# EAGLE design LoginatorCore (EAGLE 6.2)
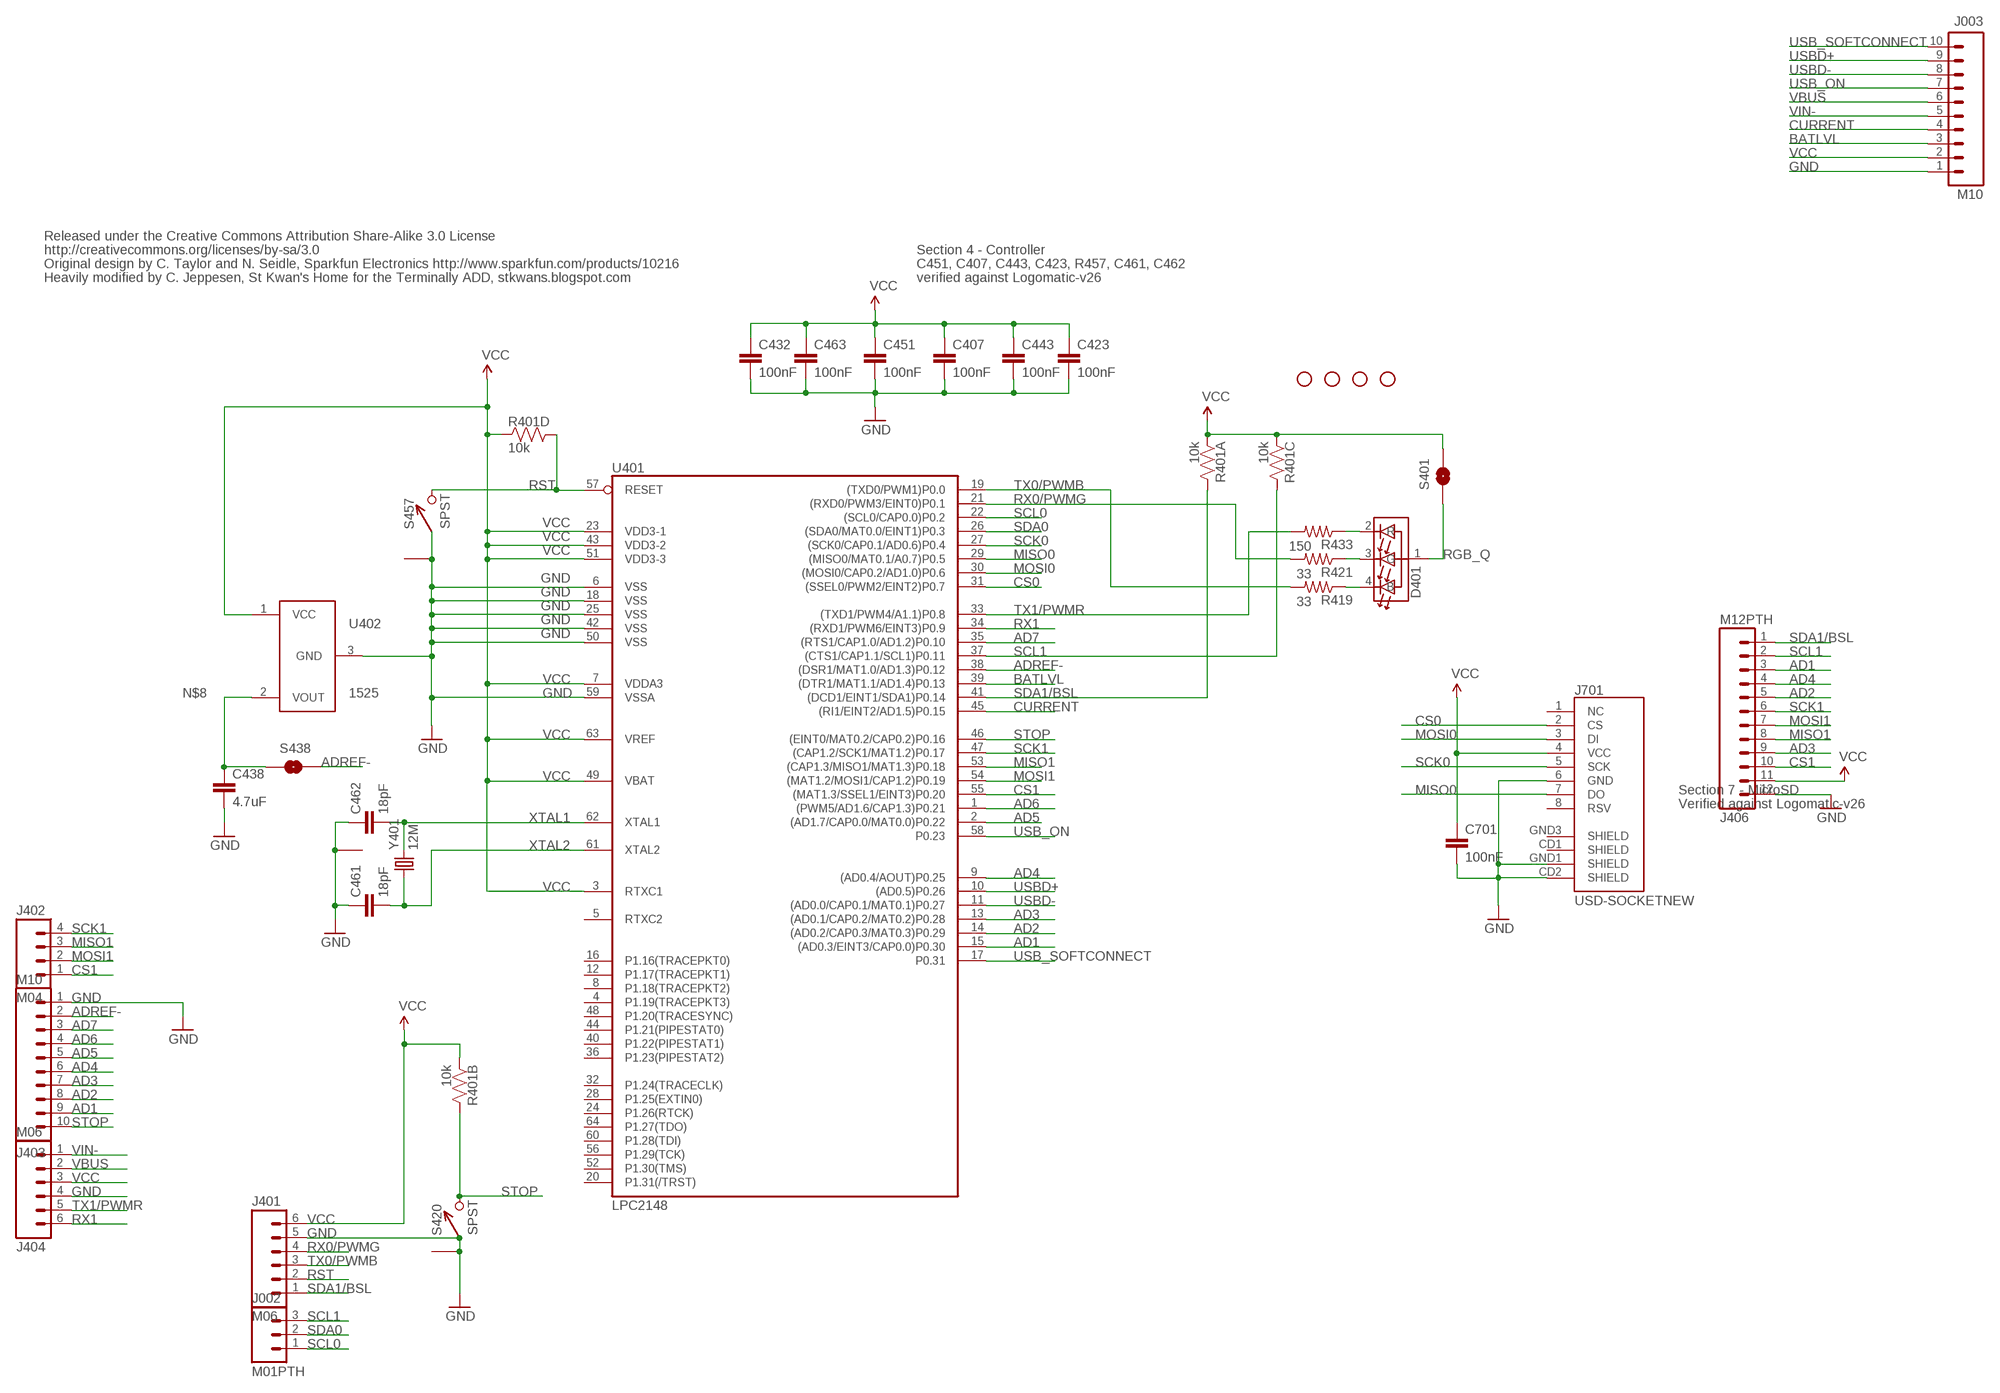
[diagram p0: schematic, sheet 1]

## Parts
C407  100nF  CAP0402-CAP  [0402-CAP]
C423  100nF  CAP0402-CAP  [0402-CAP]
C432  100nF  CAP0402-CAP  [0402-CAP]
C438  4.7uF  CAP0402-CAP  [0402-CAP]
C443  100nF  CAP0402-CAP  [0402-CAP]
C451  100nF  CAP0402-CAP  [0402-CAP]
C461  18pF  CAP0402-CAP  [0402-CAP]
C462  18pF  CAP0402-CAP  [0402-CAP]
C463  100nF  CAP0402-CAP  [0402-CAP]
C701  100nF  CAP0402-CAP  [0402-CAP]
D401  HSMF-C118  [HSMF-C118]
J002  M01PTH  M03PTH  [1X03]
J003  M10  M10"  [1X10]
J401  M06  M06SIP  [1X06]
J402  M04  M04PTH  [1X04]
J403  M10  M10"  [1X10]
J404  M06  M06SIP  [1X06]
J406  M12PTH  [1X12]
J701  USD-SOCKETNEW  [MICRO-SD-SOCKET-PP]
JP1  STAND-OFF  [STAND-OFF]
JP2  STAND-OFF  [STAND-OFF]
JP3  STAND-OFF  [STAND-OFF]
JP4  STAND-OFF  [STAND-OFF]
R401  10k  RP404  [CRA04]
R419  33  RESISTOR0402-RES  [0402-RES]
R421  33  RESISTOR0402-RES  [0402-RES]
R433  150  RESISTOR0402-RES  [0402-RES]
S401  SOLDERJUMPERNO  [SJ_2S-NO]
S420  SPST  B3U-1100P  [B3U-1100P]
S438  SOLDERJUMPERNO  [SJ_2S-NO]
S457  SPST  B3U-1100P  [B3U-1100P]
U401  LPC2148  LPC213X  [SQFP-S-10X10-64]
U402  1525  MCP1525  [SOT-23-3]
Y401  12M  TSX-3225  [CRYSTAL_SMD]

## Nets
AD1: J403.9 J406.3 U401.15((AD0.3/EINT3/CAP0.0)P0.30)
AD2: J403.8 J406.5 U401.14((AD0.2/CAP0.3/MAT0.3)P0.29)
AD3: J403.7 J406.9 U401.13((AD0.1/CAP0.2/MAT0.2)P0.28)
AD4: J403.6 J406.4 U401.9((AD0.4/AOUT)P0.25)
AD5: J403.5 U401.2((AD1.7/CAP0.0/MAT0.0)P0.22)
AD6: J403.4 U401.1((PWM5/AD1.6/CAP1.3)P0.21)
AD7: J403.3 U401.35((RTS1/CAP1.0/AD1.2)P0.10)
ADREF-: J403.2 S438.2 U401.38((DSR1/MAT1.0/AD1.3)P0.12)
BATLVL: J003.3 U401.39((DTR1/MAT1.1/AD1.4)P0.13)
CS0: J701.2(CS) U401.31((SSEL0/PWM2/EINT2)P0.7)
CS1: J402.1 J406.10 U401.55((MAT1.3/SSEL1/EINT3)P0.20)
CURRENT: J003.4 U401.45((RI1/EINT2/AD1.5)P0.15)
DB: D401.4(B) R419.1
DG: D401.3(G) R421.1
DR: D401.2(R) R433.1
GND: C407.2 C423.2 C432.2 C438.2 C443.2 C451.2 C461.1 C462.1 C463.2 C701.2 J003.1 J401.5 J403.1 J404.4 J406.12 J701.6(GND) J701.CD2(SHIELD) J701.GND1(SHIELD) S420.P$1 S420.P$3 S457.P$1 S457.P$3 U401.6(VSS) U401.18(VSS) U401.25(VSS) U401.42(VSS) U401.50(VSS) U401.59(VSSA) U402.3(GND) Y401.2 Y401.4
MISO0: J701.7(DO) U401.29((MISO0/MAT0.1/A0.7)P0.5)
MISO1: J402.3 J406.8 U401.53((CAP1.3/MISO1/MAT1.3)P0.18)
MOSI0: J701.3(DI) U401.30((MOSI0/CAP0.2/AD1.0)P0.6)
MOSI1: J402.2 J406.7 U401.54((MAT1.2/MOSI1/CAP1.2)P0.19)
N$8: C438.1 S438.1 U402.2(VOUT)
RGB_Q: D401.1(A) S401.1
RST: J401.2 R401.5 S457.P$2 U401.57(RESET)
RX0/PWMG: J401.4 R421.2 U401.21((RXD0/PWM3/EINT0)P0.1)
RX1: J404.6 U401.34((RXD1/PWM6/EINT3)P0.9)
SCK0: J701.5(SCK) U401.27((SCK0/CAP0.1/AD0.6)P0.4)
SCK1: J402.4 J406.6 U401.47((CAP1.2/SCK1/MAT1.2)P0.17)
SCL0: J002.1 U401.22((SCL0/CAP0.0)P0.2)
SCL1: J002.3 J406.2 R401.6 U401.37((CTS1/CAP1.1/SCL1)P0.11)
SDA0: J002.2 U401.26((SDA0/MAT0.0/EINT1)P0.3)
SDA1/BSL: J401.1 J406.1 R401.8 U401.41((DCD1/EINT1/SDA1)P0.14)
STOP: J403.10 R401.7 S420.P$2 U401.46((EINT0/MAT0.2/CAP0.2)P0.16)
TX0/PWMB: J401.3 R419.2 U401.19((TXD0/PWM1)P0.0)
TX1/PWMR: J404.5 R433.2 U401.33((TXD1/PWM4/A1.1)P0.8)
USB_ON: J003.7 U401.58(P0.23)
USB_SOFTCONNECT: J003.10 U401.17(P0.31)
USBD+: J003.9 U401.10((AD0.5)P0.26)
USBD-: J003.8 U401.11((AD0.0/CAP0.1/MAT0.1)P0.27)
VBUS [power]: J003.6 J404.2
VCC: C407.1 C423.1 C432.1 C443.1 C451.1 C463.1 C701.1 J003.2 J401.6 J404.3 J406.11 J701.4(VCC) R401.1 R401.2 R401.3 R401.4 S401.2 U401.3(RTXC1) U401.7(VDDA3) U401.23(VDD3-1) U401.43(VDD3-2) U401.49(VBAT) U401.51(VDD3-3) U401.63(VREF) U402.1(VCC)
VIN-: J003.5 J404.1
XTAL1: C462.2 U401.62(XTAL1) Y401.3
XTAL2: C461.2 U401.61(XTAL2) Y401.1
Unconnected: J701.1(NC) J701.8(RSV) J701.CD1(SHIELD) J701.GND3(SHIELD) U401.4(P1.19(TRACEPKT3)) U401.5(RTXC2) U401.8(P1.18(TRACEPKT2)) U401.12(P1.17(TRACEPKT1)) U401.16(P1.16(TRACEPKT0)) U401.20(P1.31(/TRST)) U401.24(P1.26(RTCK)) U401.28(P1.25(EXTIN0)) U401.32(P1.24(TRACECLK)) U401.36(P1.23(PIPESTAT2)) U401.40(P1.22(PIPESTAT1)) U401.44(P1.21(PIPESTAT0)) U401.48(P1.20(TRACESYNC)) U401.52(P1.30(TMS)) U401.56(P1.29(TCK)) U401.60(P1.28(TDI)) U401.64(P1.27(TDO))

## Notes on the sheet
- Released under the Creative Commons Attribution Share-Alike 3.0 License
- http://creativecommons.org/licenses/by-sa/3.0 | Section 4 - Controller
- Original design by C. Taylor and N. Seidle, Sparkfun Electronics http://www.sparkfun.com/products/10216 | C451, C407, C443, C423, R457, C461, C462
- Heavily modified by C. Jeppesen, St Kwan's Home for the Terminally ADD, stkwans.blogspot.com | verified against Logomatic-v26
- Section 7 - MicroSD
- Verified against Logomatic-v26

## Library data of the parts
C407 C423 C432 C438 C443 C451 C461-C463 C701 = SparkFun:CAP: Capacitor Standard 0603 ceramic capacitor, and 0.1" leaded capacitor.
D401 = KwanSystems:HSMF-C118
J002 = SparkFun:M03: Header 3 Standard 3-pin 0.1" header. Use with straight break away headers (SKU : PRT-00116), right angle break away headers (PRT-00553), swiss pins (PRT-00743), machine pins (PRT-00117), and female headers (PRT-00115). Molex polarized connector foot print use with SKU : PRT-08232 with associated crimp pins and housings.
J003 J403 = SparkFun:M10: Header 10 Standard 10-pin 0.1" header. Use with straight break away headers (SKU : PRT-00116), right angle break away headers (PRT-00553), swiss pins (PRT-00743), machine pins (PRT-00117), and female headers (PRT-00115).
J401 J404 = SparkFun:M06: Header 6 Standard 6-pin 0.1" header. Use with straight break away headers (SKU : PRT-00116), right angle break away headers (PRT-00553), swiss pins (PRT-00743), machine pins (PRT-00117), and female headers (PRT-00115). Molex polarized connector foot print use with SKU : PRT-08094 with associated crimp pins and housings. NOTES ON THE VARIANTS LOCK and LOCK_LONGPADS... This footprint was designed to help hold the alignment of a through-hole component (i.e. 6-pin header) while soldering it into place. You may notice that each hole has been shifted either up or down by 0.005 of an inch from it's more standard position (which is a perfectly straight line). This slight alteration caused the pins (the squares in the middle) to touch the edges of the holes. Because they are alternating, it causes a "brace" to hold the component in place. 0.005 has proven to be the perfect amount of "off-center" position when using our standard breakaway headers. Although looks a little odd when you look at the bare footprint, once you have a header in there, the alteration is very hard to notice. Also, if you push a header all the way into place, it is covered up entirely on the bottom side. This idea of altering the position of holes to aid alignment will be further integrated into the Sparkfun Library for other footprints. It can help hold any component with 3 or more connection pins.
J402 = SparkFun:M04: Header 4 Standard 4-pin 0.1" header. Use with straight break away headers (SKU : PRT-00116), right angle break away headers (PRT-00553), swiss pins (PRT-00743), machine pins (PRT-00117), and female headers (PRT-00115). Molex polarized connector foot print use with SKU : PRT-08231 with associated crimp pins and housings. 1MM SMD Version SKU: PRT-10208
J406 = SparkFun:M12: Header 12 Standard 12-pin 0.1" header. Use with straight break away headers (SKU : PRT-00116), right angle break away headers (PRT-00553), swiss pins (PRT-00743), machine pins (PRT-00117), and female headers (PRT-00115).
J701 = SparkFun:USD-SOCKET: microSD Socket Push-push type uSD socket. Schematic element and footprint production proven. Spark Fun Electronics SKU : PRT-00127. tDoc lines correctly indicate media card edge positions when inserting (unlocked, locked, depressed).
JP1-JP4 = SparkFun:STAND-OFF: Stand Off This is the mechanical footprint for a #4 phillips button head screw. Use the keepout ring to avoid running the screw head into surrounding components. SKU : PRT-00447
R401 = KwanSystems:RP4
R419 R421 R433 = SparkFun:RESISTOR: Resistor Basic schematic elements and footprints for 0603, 1206, and PTH resistors.
S401 S438 = SparkFun:SOLDERJUMPER: Solder Jumper Standard SMD solder jumper. Used to automate production. Two varients : Normally Open and Normally Closed are the same, but have different paste layers. NC will have a large amount of paste and should jumper during reflow.
S420 S457 = KwanSystems:B3U-1100P
U401 = SparkFun:LPC213X: LPC213x Schematic element and footprint for NXP LPC213x. Spark Fun Electronics SKU : COM-00520
U402 = KwanSystems:MCP1525
Y401 = KwanSystems:TSX-3225

## Net classes
0 default: width 0.152 mm, drill 0.33 mm, clearance 0.152 mm
1 power: width 0.152 mm, drill 0.33 mm, clearance 0.152 mm to class 0, clearance 0.152 mm
2 hv: width 0.152 mm, drill 0.33 mm, clearance 0.152 mm to class 0, clearance 0.152 mm to class 1, clearance 0.152 mm

## Board
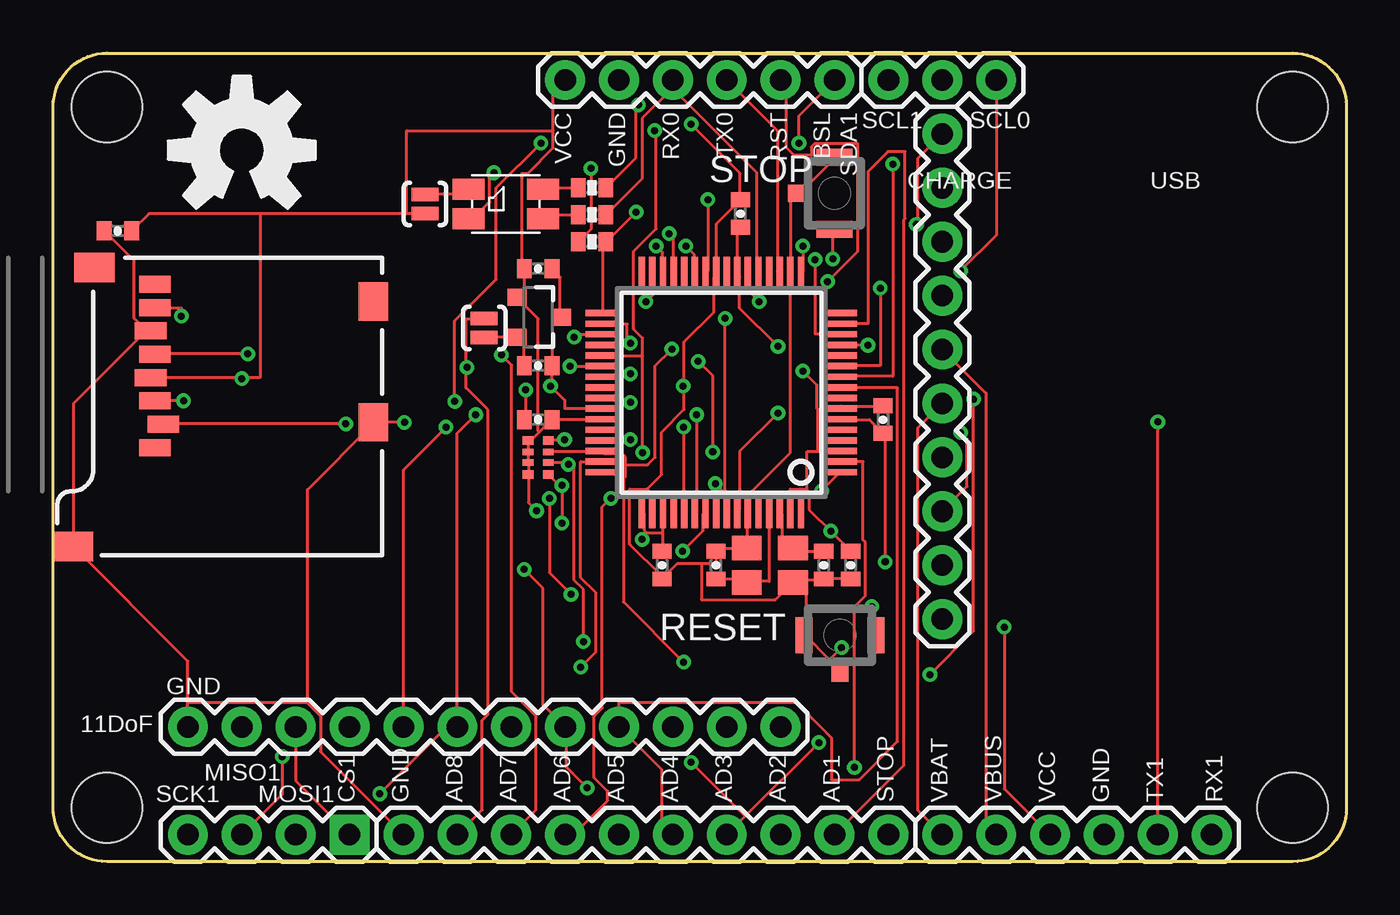
[diagram p1: board, top side]
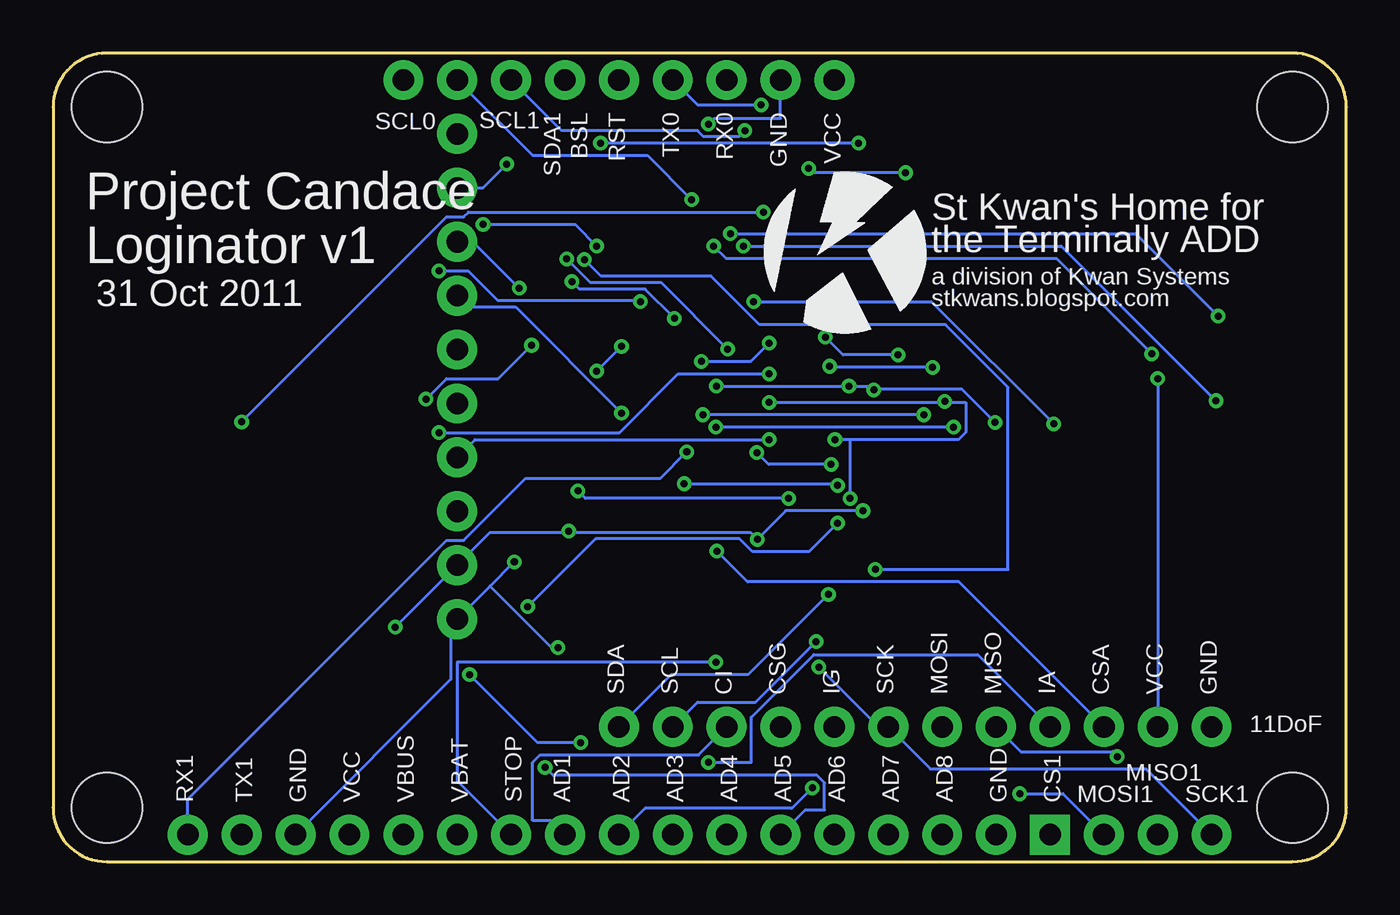
[diagram p2: board, bottom side, seen from below]

Size 60.96 x 38.1 mm. Coordinates in mm from the lower left corner, seen from the top.
Outline: 2.54,38.1 58.42,38.1 arc-90 60.96,35.56 60.96,2.54 arc-90 58.42,0 2.54,0 arc-90 0,2.54 0,35.56 arc-90 2.54,38.1
Copper layers (1*16): Top 0.0356mm / dielectric 1.5011mm / Bottom 0.0356mm
Design rules: minimum track width 6mil, minimum drill 13mil, track to track 6mil, track to pad 6mil, pad to pad 6mil, via to via 6mil, smd to smd 6mil, copper to edge 15mil, drill to drill 6mil, minimum pad ring 7mil, minimum via ring 7mil, stop-mask expansion 4mil, vias tented up to drill 14mil, thermal gap 10mil
vRestrict: area 4.8,2.8 to 7.6,3.6; area 7.1,3.8 to 10.4,4.6; area 9.4,2.8 to 13,3.6; area 13.2,2.8 to 14.5,4.8; area 15.7,2.8 to 17,4.8; area 18.3,2.8 to 19.6,4.8; area 20.8,2.8 to 22.1,4.8; area 23.4,2.8 to 24.6,4.8; area 25.9,2.8 to 27.2,4.8; area 28.4,2.8 to 29.7,4.8; area 31,2.8 to 32.3,4.8; area 33.5,2.8 to 34.8,4.8; 41 more areas

### Footprints (pad centres in the part's own frame; a part is rotated, then mirrored left to right if it is on the bottom)
0402-CAP = smd 0.7 x 0.9: 1 -0.65,0; 2 0.65,0
HSMF-C118 = smd 1.5 x 1: 1 1.75,-0.7; 2 1.75,0.7; 3 -1.75,0.7; 4 -1.75,-0.7
1X03 = drill 1.016 pad 1.88: 1 0,0; 2 2.54,0; 3 5.08,0
1X10 = drill 1.016 pad 1.88: 1 0,0; 2 2.54,0; 3 5.08,0; 4 7.62,0; 5 10.16,0; 6 12.7,0; 7 15.24,0; 8 17.78,0; 9 20.32,0; 10 22.86,0
1X06 = drill 1.016 pad 1.88: 1 0,0; 2 2.54,0; 3 5.08,0; 4 7.62,0; 5 10.16,0; 6 12.7,0
1X04 = drill 1.016 pad 1.88 square: 1 0,0 | drill 1.016 pad 1.88: 2 2.54,0; 3 5.08,0; 4 7.62,0
1X12 = drill 1.016 pad 1.88: 1 0,0; 2 2.54,0; 3 5.08,0; 4 7.62,0; 5 10.16,0; 6 12.7,0; 7 15.24,0; 8 17.78,0; 9 20.32,0; 10 22.86,0; 11 25.4,0; 12 27.94,0
MICRO-SD-SOCKET-PP = smd 0.8 x 1.5: 1 -8.94,10.7; 2 -7.84,10.3; 3 -6.74,10.7; 4 -5.64,10.9; 5 -4.54,10.7; 6 -3.44,10.9; 7 -2.34,10.7; 8 -1.24,10.7 | smd 1.8 x 1.4: CD1 -2.05,0.4; CD2 -7.75,0.4 | smd 1.4 x 1.9: GND1 -13.6,14.55; GND3 -0.45,13.55
STAND-OFF = hole 3.302: 0,0
CRA04 = smd 0.4 x 0.5: 1 -0.8,-0.475; 4 0.8,-0.475; 5 0.8,0.475; 8 -0.8,0.475 | smd 0.3 x 0.5: 2 -0.25,-0.475; 3 0.25,-0.475; 6 0.25,0.475; 7 -0.25,0.475
0402-RES = smd 0.7 x 0.9: 1 -0.65,0; 2 0.65,0
SJ_2S-NO = smd 0.635 x 1.27: 1 -0.45,0; 2 0.45,0
B3U-1100P = smd 0.8 x 1.7: P$1 -1.7,0; P$2 1.7,0 | smd 0.8 x 1.1: P$3 0,-1.65
SQFP-S-10X10-64 = smd 0.3 x 1.6: 1 -3.75,-5.6; 2 -3.25,-5.6; 3 -2.75,-5.6; 4 -2.25,-5.6; 5 -1.75,-5.6; 6 -1.25,-5.6; 7 -0.75,-5.6; 8 -0.25,-5.6; 9 0.25,-5.6; 10 0.75,-5.6; 11 1.25,-5.6; 12 1.75,-5.6; 13 2.25,-5.6; 14 2.75,-5.6; 15 3.25,-5.6; 16 3.75,-5.6; 33 3.75,5.6; 34 3.25,5.6; 35 2.75,5.6; 36 2.25,5.6; 37 1.75,5.6; 38 1.25,5.6; 39 0.75,5.6; 40 0.25,5.6; 41 -0.25,5.6; 42 -0.75,5.6; 43 -1.25,5.6; 44 -1.75,5.6; 45 -2.25,5.6; 46 -2.75,5.6; 47 -3.25,5.6; 48 -3.75,5.6 | smd 1.6 x 0.3: 17 5.6,-3.75; 18 5.6,-3.25; 19 5.6,-2.75; 20 5.6,-2.25; 21 5.6,-1.75; 22 5.6,-1.25; 23 5.6,-0.75; 24 5.6,-0.25; 25 5.6,0.25; 26 5.6,0.75; 27 5.6,1.25; 28 5.6,1.75; 29 5.6,2.25; 30 5.6,2.75; 31 5.6,3.25; 32 5.6,3.75; 49 -5.6,3.75; 50 -5.6,3.25; 51 -5.6,2.75; 52 -5.6,2.25; 53 -5.6,1.75; 54 -5.6,1.25; 55 -5.6,0.75; 56 -5.6,0.25; 57 -5.6,-0.25; 58 -5.6,-0.75; 59 -5.6,-1.25; 60 -5.6,-1.75; 61 -5.6,-2.25; 62 -5.6,-2.75; 63 -5.6,-3.25; 64 -5.6,-3.75
SOT-23-3 = smd 0.9 x 0.8: 1 -1,0.95; 2 -1,-0.95; 3 1.1,0
CRYSTAL_SMD = smd 1.4 x 1.15: 1 -1.092,-0.813; 2 1.092,-0.813; 3 1.092,0.813; 4 -1.092,0.813

### Placement (x,y rotation side)
C407  39.12,20.83 270 top
C423  32.39,30.54 90 top
C432  22.86,27.94 0 top
C438  22.86,23.37 0 top
C443  22.86,20.83 180 top
C451  28.7,13.97 270 top
C461  31.24,13.97 270 top
C462  36.32,13.97 90 top
C463  37.59,13.97 270 top
C701  3.05,29.72 180 top
D401  21.34,30.99 180 top
J002  44.45,36.83 180 top
J003  41.91,11.43 90 top
J401  36.83,36.83 180 top
J402  13.97,1.27 180 top
J403  16.51,1.27 0 top
J404  41.91,1.27 0 top
J406  34.29,6.35 180 top
J701  15.49,28.45 90 top
JP1  2.54,2.54 0 top
JP2  58.42,2.54 0 top
JP3  2.54,35.56 0 top
JP4  58.42,35.56 0 top
R401  22.86,19.05 270 top
R419  25.4,31.75 0 top
R421  25.4,30.48 0 top
R433  25.4,29.21 0 top
S401  17.53,30.99 270 top
S420  36.83,31.5 270 top
S438  20.32,25.15 90 top
S457  37.08,10.67 0 top
U401  31.5,22.1 90 top
U402  22.86,25.65 0 top
U$1  [KWAN_CIRCLE]  23.62,28.7 0 bottom
U$2  [OSHW-LOGO-L]  8.89,33.53 0 top
Y401  33.78,13.97 0 top

### Tracks (layer width: path | path; a pad name or v marks a point on that pad's centre or on a via)
AD1
  Top 0.152: J403.9 40.11,4.55 40.11,30.25 40.16,30.3 40.16,33.45 39.34,33.45 38.41,32.51 38.41,25.35 U401.15
  Bottom 0.152: J406.3 30.53,5.03 38,5.03 38.35,4.67 38.35,1.93 37.49,1.93 J403.9
AD2  (via drill 0.33)
  Top 0.152: v35.92,28.37 35.92,24.87 37.08,24.87 U401.14 | v22.2,13.77 23.09,12.88 23.09,7.39 J406.5 24.18,6.3 24.18,4.47 v25.17,3.48
  Bottom 0.152: v35.92,28.37 35.13,27.58 29.95,27.58 27.66,25.3 18.9,25.3 15.95,22.35 15.95,13.77 v22.2,13.77 | J403.8 33.05,2.52 26.14,2.52 v25.17,3.48
AD3  (via drill 0.33)
  Top 0.152: v38.41,24.33 37.11,24.33 U401.13 | v43.38,21.79 43.38,10.87 v41.33,8.81 | J403.7 32.61,2.13 | 32.61,2.13 v36.09,5.61 | 32.61,2.13 v30.07,4.67
  Bottom 0.152: v38.41,24.33 39.98,22.76 42.42,22.76 v43.38,21.79 | v41.33,8.81 38.12,5.61 v36.09,5.61 | J406.9 17.37,9.75 25.09,9.75 28.04,6.81 28.04,4.67 v30.07,4.67
AD4
  Top 0.152: U401.9 37.11,22.33 39.8,22.33 39.8,5.66 38,3.86 36.68,3.86 36.68,5.84 35,7.52 26.67,7.52 J406.4 28.68,4.34 28.68,1.8 J403.6
AD5  (via drill 0.33)
  Top 0.152: v37.77,4.45 37.77,12.01 38.28,12.52 38.28,15.06 38.18,15.16 38.18,18.85 U401.2
  Bottom 0.152: v37.77,4.45 37.39,4.06 24.94,4.06 24.59,3.71 24.59,2.44 25.5,2.44 J403.5
AD6  (via drill 0.33)
  Top 0.152: v36.22,17.48 37.08,18.34 U401.1 | v26.29,17.12 25.88,16.71 25.88,7.24 25.5,6.86 25.5,3.96 26.14,3.33 26.14,2.87 24.54,1.27 J403.4
  Bottom 0.152: v36.22,17.48 35.87,17.12 v26.29,17.12
AD7  (via drill 0.33)
  Top 0.152: v24.56,24.71 24.56,24.84 25.88,24.84 U401.35 | v21.13,23.88 21.61,23.39 21.61,8 22.76,6.86 22.76,2.44 J403.3
  Bottom 0.152: v24.56,24.71 23.72,23.88 v21.13,23.88
ADREF-  (via drill 0.33)
  Top 0.152: 19.46,23.29 19.46,22.33 20.5,21.29 20.5,6.93 20.22,6.66 20.22,2.44 J403.2 | 19.46,23.29 19.46,25.58 20.32,25.58 S438.2 | v24.36,23.34 25.88,23.34 U401.38 | v19.51,23.29 19.46,23.29
  Bottom 0.152: v24.36,23.34 24.31,23.29 v19.51,23.29
BATLVL  (via drill 0.33)
  Top 0.152: v27.2,22.99 27.2,22.86 U401.39 | v42.77,20.22 43.08,19.91 43.08,17.68 J003.3
  Bottom 0.152: v27.2,22.99 31.5,22.99 34.27,20.22 v42.77,20.22
CS0  (via drill 0.33)
  Top 0.152: v13.79,20.62 5.21,20.62 J701.2 | v27.94,26.39 28.25,26.7 28.25,27.69 U401.31
  Bottom 0.152: v13.79,20.62 19.56,26.39 v27.94,26.39
CS1  (via drill 0.33)
  Top 0.152: v29.67,14.63 30.63,15.6 30.63,16.38 30.73,16.48 U401.55 | J402.1 11.43,3.81 J406.10
  Bottom 0.152: v29.67,14.63 28.22,13.18 18.26,13.18 J406.10
CURRENT  (via drill 0.33)
  Top 0.152: v27.2,19.89 27.2,19.86 25.91,19.86 U401.45
  Bottom 0.152: v27.2,19.89 41.07,19.89 J003.4
DB
  Top 0.152: R419.1 23.09,31.75 D401.4
DG
  Top 0.152: R421.1 23.09,30.48 23.09,30.3 D401.3
DR  (via drill 0.33)
  Top 0.152: v25.35,32.66 25.35,29.79 24.77,29.21 R433.1 | v20.78,32.46 20.57,32.26 20.57,31.09 19.79,30.3 19.61,30.3 D401.2
  Bottom 0.152: v25.35,32.66 25.15,32.46 v20.78,32.46
GND  (via drill 0.33)
  Top 0.152: v22.28,22.23 22.28,20.88 22.23,20.83 C443.2 | C432.2 23.9,27.56 23.9,25.7 U402.3 23.55,25.25 23.55,23.42 C438.2 23.5,23.37 23.5,22.45 v23.44,22.4 24.11,21.74 24.11,21.36 25.88,21.36 U401.42 | v16.56,20.7 15.11,20.7 J701.CD2 15.09,20.62 11.99,17.53 11.99,7.57 11.94,7.52 | C701.2 2.41,29.72 3.81,28.32 3.81,25.6 4.39,25.02 4.57,25.02 J701.6 4.34,24.97 0.96,21.59 0.96,14.91 J701.GND1 0.96,14.83 6.35,9.45 6.35,7.52 | J406.12 6.35,7.52 | J403.1 12.6,5.18 12.6,6.86 11.94,7.52 | 6.35,7.52 11.94,7.52 | U401.6 37.11,20.83 38.48,20.83 39.12,20.19 C407.2 39.14,20.12 39.22,20.04 v39.22,14.12 | S420.P$1 36.83,33.12 35.2,31.5 S420.P$3 35.13,31.45 34.75,31.06 U401.18 34.75,27.64 34.75,19.28 32.79,17.32 32.79,16.56 U401.59 32.74,16.48 32.72,16.46 32.72,14.83 | C463.2 37.59,13.34 36.32,13.34 C462.1 36.27,13.28 34.9,13.28 34.9,13.18 Y401.2 | 36.6,9.53 35.46,10.67 S457.P$1 35.51,10.72 35.51,13.23 Y401.2 | 36.6,9.53 37.08,9.04 S457.P$3 | 30.56,14.05 31.24,14.05 C461.1 31.27,14.68 31.27,14.76 32.66,14.76 | 30.56,14.05 29.41,14.05 28.7,13.34 C451.2 28.7,13.44 27.18,14.96 27.18,17.55 27.99,17.55 | 27.99,17.55 28.14,17.4 28.14,16.61 U401.50 | 29.74,22.4 29.74,21.31 28.68,20.24 28.68,18.24 27.99,17.55 | 29.74,22.4 29.74,24.49 31.14,25.88 31.14,27.56 31.22,27.64 U401.25 31.27,27.71 31.27,30.05 32.38,31.17 C423.2 32.38,31.27 32.38,32.44 v30.07,34.75 | 30.56,14.05 30.56,12.34 34.04,12.34 34.82,13.13 Y401.2 | 36.6,9.53 v37.16,10.08 | v29.69,22.4 29.74,22.4
  Top 0.406: Y401.4 32.72,14.78 32.72,14.83
  Bottom 0.152: v16.56,20.7 18.14,22.28 22.23,22.28 v22.28,22.23 22.45,22.4 v23.44,22.4 v29.69,22.4 | 40.36,12.98 J003.1 41.96,11.38 42.22,11.38 42.22,8.59 J404.4 | 40.36,12.98 v39.22,14.12 | J401.5 26.67,35.03 29.79,35.03 v30.07,34.75 | 40.36,12.98 37.47,10.08 v37.16,10.08
MISO0  (via drill 0.33)
  Top 0.152: v6.04,25.7 6.04,26.09 4.8,26.09 J701.7 | v29.03,29.59 29.23,29.39 29.23,27.71 U401.29
  Bottom 0.152: v6.04,25.7 9.93,29.59 v29.03,29.59
MISO1  (via drill 0.33)
  Top 0.152: v29.72,20.47 29.72,16.54 U401.53 | v18.52,20.47 16.51,18.47 J406.8 | J402.3 10.79,3.17 v10.79,4.95
  Bottom 0.152: v18.52,20.47 v29.72,20.47 | v10.79,4.95 11.02,5.18 15.34,5.18 J406.8
MOSI0  (via drill 0.33)
  Top 0.152: v6.15,21.72 J701.3 | v28.42,29.01 28.73,28.7 28.73,27.71 U401.30
  Bottom 0.152: v6.15,21.72 13.44,29.01 v28.42,29.01
MOSI1  (via drill 0.33)
  Top 0.152: v30.33,21.06 30.33,16.59 U401.54 | v19.91,21.06 19.05,20.19 J406.7 19,6.81 v15.39,3.2
  Bottom 0.152: v19.91,21.06 v30.33,21.06 | J402.2 13.36,3.2 v15.39,3.2
N$8
  Top 0.152: C438.1 22.2,24.36 U402.2 21.79,24.71 20.32,24.71 S438.1
RGB_Q
  Top 0.152: S401.1 19.58,31.45 19.58,31.67 D401.1
RST  (via drill 0.33)
  Top 0.152: 31.62,17.4 31.73,17.3 31.73,16.51 U401.57 | 31.62,17.4 v31.22,17.8 | R401.5 23.34,18.24 23.95,17.63 23.98,17.63 v23.98,17.73 v23.98,15.95 | v38.58,12.01 38.58,10.85 38.76,10.67 S457.P$2 | J401.2 34.57,36.55 34.57,33.63 34.92,33.27 35.74,33.27 35.74,33.68 35.89,33.83 37.92,33.83 37.92,28.75 v36.5,27.33 | v31.67,25.6 31.67,17.45 31.62,17.4
  Bottom 0.152: v23.98,17.73 24.05,17.8 v31.22,17.8 | v38.58,12.01 35.38,15.21 28.6,15.21 27.99,14.61 25.32,14.61 v23.98,15.95 | v36.5,27.33 36.14,26.98 33.05,26.98 v31.67,25.6
RX0/PWMG
  Top 0.152: R421.2 27.76,32.18 27.76,35.03 29.21,36.47 J401.4 29.23,36.4 33.15,32.49 33.15,27.79 33.22,27.71 U401.21
RX1  (via drill 0.33)
  Top 0.152: v27.2,24.43 27.05,24.59 27.05,25.32 25.91,25.32 U401.34 | v30.4,23.57 31.09,22.89 v31.09,19.3
  Bottom 0.152: v27.2,24.43 28.07,23.57 v30.4,23.57 | v31.09,19.3 32.33,18.06 38.68,18.06 41.6,15.14 42.42,15.14 54.61,2.95 J404.6
SCK0  (via drill 0.33)
  Top 0.152: v9.17,23.93 4.8,23.93 J701.5 | v29.82,29.01 30.23,28.6 30.23,27.71 U401.27
  Bottom 0.152: v9.17,23.93 13.66,28.42 29.23,28.42 v29.82,29.01
SCK1  (via drill 0.33)
  Top 0.152: v24.87,9.17 25.58,9.88 25.58,12.68 24.87,13.39 24.87,18.85 25.88,18.85 U401.47
  Bottom 0.152: v24.87,9.17 22.05,6.35 J406.6 19.61,4.37 9.45,4.37 J402.4
SCL0  (via drill 0.33)
  Top 0.152: v33.27,26.39 32.84,26.82 32.84,27.61 32.77,27.69 U401.22 | v42.77,27.84 44.45,29.52 J002.1
  Bottom 0.152: v33.27,26.39 33.33,26.44 40.01,26.44 41.4,27.84 v42.77,27.84
SCL1  (via drill 0.33)
  Top 0.152: 24.28,18.8 24.56,18.8 24.56,13.26 24.99,12.83 v24.99,10.36 | 24.28,18.8 R401.6 | 27.79,23.82 25.91,23.82 U401.37 | v27.79,19.28 27.79,23.82 | v24.28,18.72 24.28,18.8 | v28.35,34.44 28.42,34.37 28.42,29.82 27.36,28.75 27.36,25.09 27.79,24.66 27.79,23.82
  Bottom 0.152: v24.99,10.36 27.84,7.52 30.58,7.52 J406.2 | v27.79,19.28 27.23,18.72 v24.28,18.72 | J002.3 36.98,34.44 30.58,34.44 30.3,34.16 28.63,34.16 v28.35,34.44
SDA0  (via drill 0.33)
  Top 0.152: U401.26 30.86,27.81 v30.86,31.19
  Bottom 0.152: v30.86,31.19 32.94,33.27 38.35,33.27 J002.2
SDA1/BSL  (via drill 0.33)
  Top 0.152: v24.11,19.89 24.11,19.86 23.34,19.86 R401.8 | v27.2,21.64 26.9,21.64 26.7,21.84 U401.41 | v24.41,12.6 23.39,13.61 v23.39,17.12 | J401.1 35.15,35.15 v35.15,33.86 | v22.99,33.86 20.88,31.75 20.88,27.43 18.92,25.48 v18.92,21.69
  Bottom 0.152: 23.39,19.89 18.29,19.89 17.93,20.24 17.93,21.64 18.92,21.64 | 23.39,19.89 v24.11,19.89 | v27.2,21.64 18.92,21.64 | J406.1 31.83,8.81 28.19,8.81 v24.41,12.6 | 23.39,19.89 v23.39,17.12 | v22.99,33.86 v35.15,33.86 | v18.92,21.69 18.92,21.64
STOP  (via drill 0.33)
  Top 0.152: R401.7 25.88,19.3 25.88,19.33 U401.46 25.93,19.25 26.77,19.25 26.95,19.07 26.95,18.69 | v36.75,28.4 36.75,29.72 S420.P$2 | v29.16,24.16 28.37,23.37 28.37,19.05 28.02,18.69 26.95,18.69 | v29.72,9.4 26.87,12.24 26.87,18.03 26.95,18.11 26.95,18.69
  Bottom 0.152: v36.75,28.4 35.64,27.28 32.28,27.28 v29.16,24.16 | J403.10 41.91,3.81 41.91,9.4 v29.72,9.4
TX0/PWMB  (via drill 0.33)
  Top 0.152: v27.58,35.66 27.46,35.53 27.46,33.15 R419.2 | J401.3 34.14,34.44 34.14,27.81 34.24,27.71 U401.19
  Bottom 0.152: v27.58,35.66 30.58,35.66 J401.3
TX1/PWMR  (via drill 0.33)
  Top 0.152: U401.33 25.91,29.08 26.04,29.21 R433.2 26.11,29.23 v27.48,30.61 | J404.5 v52.07,20.73
  Bottom 0.152: v27.48,30.61 41.38,30.61 41.6,30.38 42.42,30.38 v52.07,20.73
USB_ON  (via drill 0.33)
  Top 0.152: U401.58 32.36,16.61 32.36,19.33 v34.16,21.13
  Bottom 0.152: v34.16,21.13 39.17,26.14 41.38,26.14 J003.7
USB_SOFTCONNECT  (via drill 0.33)
  Top 0.152: v35.33,29.01 35.33,27.79 U401.17 | v40.69,30.02 40.74,30.07 40.74,33.12 J003.10
  Bottom 0.152: v35.33,29.01 36.35,30.02 v40.69,30.02
USBD+  (via drill 0.33)
  Top 0.152: v39.57,32.87 39.57,22.86 U401.10
  Bottom 0.152: v39.57,32.87 40.69,31.75 J003.9
USBD-  (via drill 0.33)
  Top 0.152: v38.99,27.03 38.99,23.37 37.11,23.37 U401.11
  Bottom 0.152: v38.99,27.03 41.17,29.21 J003.8
VBUS
  Top 0.152: J404.2 43.97,1.75 43.97,22.07 J003.6
VCC  (via drill 0.33)
  Top 0.152: C423.1 32.38,29.87 32.26,29.74 U401.23 32.28,27.64 32.36,27.56 32.36,26.09 v34.16,24.28 | C407.1 39.12,21.46 37.11,21.46 37.11,21.36 U401.7 37.03,21.31 36.04,21.31 | 35.48,17.55 35.64,17.4 35.64,16.59 v36.65,15.57 C463.1 | 35.48,17.55 34.75,17.55 U401.63 | 36.04,19.33 35.53,19.33 35.53,17.6 35.48,17.55 | 36.04,19.33 37.08,19.33 U401.3 | 36.04,19.33 36.04,21.31 | v35.33,23.11 35.99,22.45 35.99,21.36 36.04,21.31 | 28.73,15.47 28.73,16.48 U401.51 | 28.73,15.47 28.73,14.66 C451.1 | 27.99,15.47 27.86,15.6 27.86,16.38 27.76,16.48 U401.49 | 28.73,15.47 27.99,15.47 | 27.99,15.47 27.76,15.24 v27.76,15.19 | J404.3 44.83,3.43 v44.83,11.05 | 22.91,20.24 22.45,19.79 R401.1 22.4,19.84 22.4,19.36 R401.2 22.4,19.28 22.4,18.87 R401.3 22.4,18.8 22.4,18.26 R401.4 22.4,18.19 22.4,16.92 v22.78,16.54 | 22.91,20.24 23.5,20.83 C443.1 23.57,20.85 25.88,20.85 U401.43 | 22.91,20.24 22.86,20.3 22.86,25.58 21.89,26.54 U402.1 21.87,26.62 22.2,26.95 C432.1 22.15,27.99 22.1,28.04 22.1,32.44 22.38,32.44 23.57,33.63 23.57,34.44 | J401.6 23.57,36.27 23.57,34.44 | 16.66,30.53 S401.2 | 16.66,30.53 9.75,30.53 | 9.75,30.53 4.52,30.53 C701.1 | 8.89,22.81 9.75,22.81 9.75,30.53 | 8.89,22.81 J701.4 | v8.89,22.76 8.89,22.81 | 23.57,34.44 16.66,34.44 16.66,30.53
  Bottom 0.152: v35.33,23.11 v34.16,24.28 | 36.65,15.52 40.36,15.52 J003.2 v44.83,11.05 | 36.65,15.52 28.09,15.52 v27.76,15.19 26.42,16.54 v22.78,16.54 | v36.65,15.57 36.65,15.52 | v8.89,22.76 J406.11
VIN-
  Top 0.152: J404.1 40.74,2.44 40.74,20.42 J003.5
XTAL1
  Top 0.152: C462.2 34.9,14.63 34.9,14.76 Y401.3 34.85,14.83 34.37,15.32 34.37,16.38 34.27,16.48 U401.62
XTAL2
  Top 0.152: U401.61 33.75,13.21 32.77,13.21 32.72,13.26 | 32.72,13.26 32.72,13.31 C461.2 | 32.72,13.26 Y401.1

### Text on the board
tPlace: VCC | GND | RX0 | TX0 | RST | BSL | SDA1 | SCL1 | SCL0 | STOP | CHARGE | USB | RESET | GND | 11DoF | MISO1 | SCK1 | MOSI1 | CS1 | GND | AD8 | AD7 | AD6 | AD5 | AD4 | AD3 | AD2 | AD1 | STOP | VBAT | VBUS | VCC | GND | TX1 | RX1
bPlace: VCC | GND | RX0 | TX0 | RST | BSL | SDA1 | SCL1 | SCL0 | Project Candace | St Kwan's Home for | the Terminally ADD | Loginator v1 | a division of Kwan Systems | stkwans.blogspot.com | 31 Oct 2011 | GND | VCC | CSA | IA | MISO | MOSI | SCK | IG | CSG | CI | SCL | SDA | 11DoF | MISO1 | SCK1 | MOSI1 | CS1 | GND | AD8 | AD7 | AD6 | AD5 | AD4 | AD3 | AD2 | AD1 | STOP | VBAT | VBUS | VCC | GND | TX1 | RX1
Document: Released under the Creative Commons Attribution Share-Alike 3.0 License | http://creativecommons.org/licenses/by-sa/3.0 | Original design by C. Taylor and N. Seidle, Sparkfun Electronics http://www.sparkfun.com/products/10216 | Heavily modified by C. Jeppesen, St Kwan's Home for the Terminally ADD, stkwans.blogspot.com